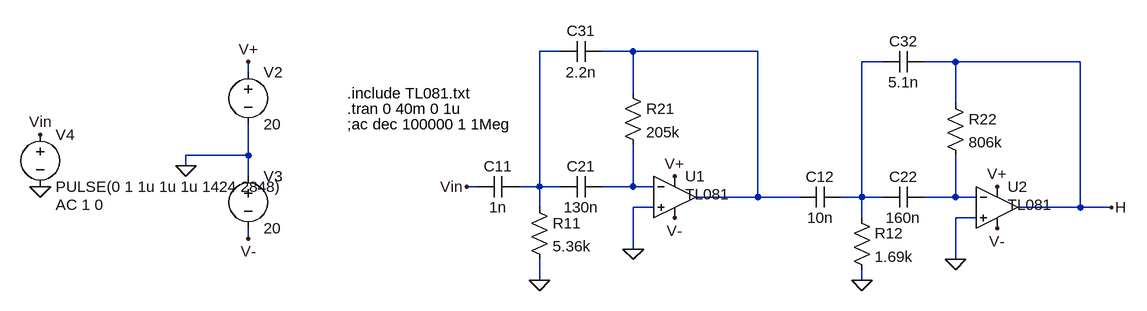
[diagram p0: schematic Punto6.asc]
Punto6.asc, the LTspice schematic file:
Version 4
SHEET 1 1160 680
WIRE 32 -64 0 -64
WIRE 144 -64 96 -64
WIRE 336 -64 144 -64
WIRE 528 -48 496 -48
WIRE 640 -48 592 -48
WIRE 832 -48 640 -48
WIRE -448 -32 -448 -48
WIRE 144 0 144 -64
WIRE 640 16 640 -48
WIRE -448 96 -448 48
WIRE -448 96 -544 96
WIRE -544 112 -544 96
WIRE -448 128 -448 96
WIRE -96 144 -112 144
WIRE 0 144 0 -64
WIRE 0 144 -32 144
WIRE 32 144 0 144
WIRE 144 144 144 80
WIRE 144 144 96 144
WIRE 176 144 144 144
WIRE 336 160 336 -64
WIRE 336 160 240 160
WIRE 400 160 336 160
WIRE 496 160 496 -48
WIRE 496 160 464 160
WIRE 528 160 496 160
WIRE 640 160 640 96
WIRE 640 160 592 160
WIRE 672 160 640 160
WIRE 0 176 0 144
WIRE 176 176 144 176
WIRE 832 176 832 -48
WIRE 832 176 736 176
WIRE 880 176 832 176
WIRE 496 192 496 160
WIRE 672 192 640 192
WIRE -448 224 -448 208
WIRE 144 240 144 176
WIRE 640 256 640 192
WIRE 0 288 0 256
WIRE 496 288 496 272
FLAG 144 240 0
FLAG -544 112 0
FLAG -448 -48 V+
FLAG -448 224 V-
FLAG 640 256 0
FLAG 880 176 H
FLAG 496 288 0
FLAG 0 288 0
FLAG -112 144 Vin
FLAG -768 64 Vin
FLAG -768 144 0
FLAG 208 128 V+
FLAG 704 144 V+
FLAG 208 192 V-
FLAG 704 208 V-
SYMBOL voltage -448 -48 R0
WINDOW 123 0 0 Left 0
WINDOW 39 0 0 Left 0
SYMATTR InstName V2
SYMATTR Value 20
SYMBOL voltage -448 112 R0
WINDOW 123 0 0 Left 0
WINDOW 39 0 0 Left 0
SYMATTR InstName V3
SYMATTR Value 20
SYMBOL voltage -768 48 R0
WINDOW 123 24 124 Left 2
WINDOW 39 0 0 Left 0
SYMATTR Value2 AC 1 0
SYMATTR InstName V4
SYMATTR Value PULSE(0 1 1u 1u 1u 1424 2848)
SYMBOL OpAmps\\opamp2 208 96 R0
WINDOW 3 16 60 Left 2
SYMATTR Value TL081
SYMATTR InstName U1
SYMBOL OpAmps\\opamp2 704 112 R0
WINDOW 3 16 60 Left 2
SYMATTR Value TL081
SYMATTR InstName U2
SYMBOL cap -32 128 R90
WINDOW 0 0 32 VBottom 2
WINDOW 3 32 32 VTop 2
SYMATTR InstName C11
SYMATTR Value 1n
SYMBOL res -16 160 R0
SYMATTR InstName R11
SYMATTR Value 5.36k
SYMBOL cap 96 128 R90
WINDOW 0 0 32 VBottom 2
WINDOW 3 32 32 VTop 2
SYMATTR InstName C21
SYMATTR Value 130n
SYMBOL cap 96 -80 R90
WINDOW 0 0 32 VBottom 2
WINDOW 3 32 32 VTop 2
SYMATTR InstName C31
SYMATTR Value 2.2n
SYMBOL res 128 -16 R0
SYMATTR InstName R21
SYMATTR Value 205k
SYMBOL cap 592 -64 R90
WINDOW 0 0 32 VBottom 2
WINDOW 3 32 32 VTop 2
SYMATTR InstName C32
SYMATTR Value 5.1n
SYMBOL res 624 0 R0
SYMATTR InstName R22
SYMATTR Value 806k
SYMBOL cap 592 144 R90
WINDOW 0 0 32 VBottom 2
WINDOW 3 32 32 VTop 2
SYMATTR InstName C22
SYMATTR Value 160n
SYMBOL res 480 176 R0
SYMATTR InstName R12
SYMATTR Value 1.69k
SYMBOL cap 464 144 R90
WINDOW 0 0 32 VBottom 2
WINDOW 3 32 32 VTop 2
SYMATTR InstName C12
SYMATTR Value 10n
TEXT -296 48 Left 2 !;ac dec 100000 1 1Meg
TEXT -296 24 Left 2 !.tran 0 40m 0 1u
TEXT -296 0 Left 2 !.include TL081.txt

The netlist it stands for:
* Punto6.asc
V2 V+ 0 20
V3 0 V- 20
V4 Vin 0 PULSE(0 1 1u 1u 1u 1424 2848) AC 1 0
XU1 0 N004 V+ V- N002 TL081  ; pins In+ In- V+ V- OUT
XU2 0 N005 V+ V- H TL081  ; pins In+ In- V+ V- OUT
C11 N001 Vin 1n
R11 N001 0 5.36k
C21 N004 N001 130n
C31 N002 N001 2.2n
R21 N002 N004 205k
C32 H N003 5.1n
R22 H N005 806k
C22 N005 N003 160n
R12 N003 0 1.69k
C12 N003 N002 10n
;ac dec 100000 1 1Meg
.tran 0 40m 0 1u
.include TL081.txt
.backanno
.end